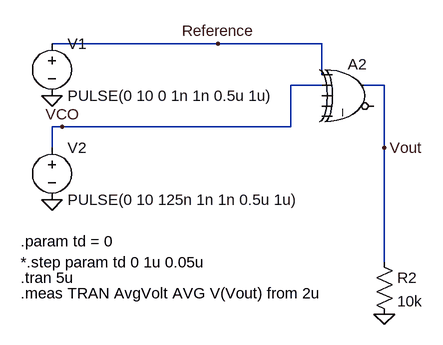
[diagram p0: schematic XORTest.asc]
XORTest.asc, the LTspice schematic file:
Version 4.1
SHEET 1 6756 736
WIRE -1280 -160 -1536 -160
WIRE -1120 -160 -1280 -160
WIRE -1120 -112 -1120 -160
WIRE -1120 -96 -1168 -96
WIRE -1024 -96 -1056 -96
WIRE -1520 -32 -1536 -32
WIRE -1168 -32 -1168 -96
WIRE -1168 -32 -1520 -32
WIRE -1536 0 -1536 -32
WIRE -1024 0 -1024 -96
WIRE -1024 176 -1024 0
FLAG -1536 80 0
FLAG -1536 -80 0
FLAG -1024 256 0
FLAG -1024 0 Vout
FLAG -1280 -160 Reference
FLAG -1520 -32 VCO
SYMBOL voltage -1536 -176 R0
WINDOW 123 0 0 Left 0
WINDOW 39 0 0 Left 0
SYMATTR InstName V1
SYMATTR Value PULSE(0 10 0 1n 1n 0.5u 1u)
SYMBOL voltage -1536 -16 R0
WINDOW 123 0 0 Left 0
WINDOW 39 0 0 Left 0
SYMATTR InstName V2
SYMATTR Value PULSE(0 10 125n 1n 1n 0.5u 1u)
SYMBOL Digital\\xor -1072 -144 R0
WINDOW 3 0 0 Invisible 0
SYMATTR Value Vhigh=10 Ref=0.5
SYMATTR InstName A2
SYMBOL res -1040 160 R0
SYMATTR InstName R2
SYMATTR Value 10k
TEXT -1584 144 Left 2 !.param td = 0
TEXT -1584 176 Left 2 !*.step param td 0 1u 0.05u
TEXT -1584 200 Left 2 !.tran 5u
TEXT -1584 224 Left 2 !.meas TRAN AvgVolt AVG V(Vout) from 2u

The netlist it stands for:
* XORTest.asc
V1 Reference 0 PULSE(0 10 0 1n 1n 0.5u 1u)
V2 VCO 0 PULSE(0 10 125n 1n 1n 0.5u 1u)
A2 Reference VCO 0 0 0 0 Vout 0 XOR Vhigh=10 Ref=0.5
R2 Vout 0 10k
.param td = 0
*.step param td 0 1u 0.05u
.tran 5u
.meas TRAN AvgVolt AVG V(Vout) from 2u
.backanno
.end